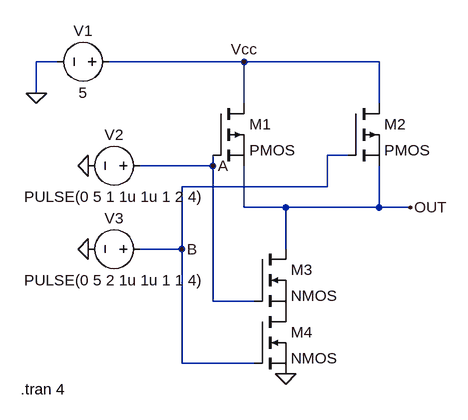
[diagram p0: schematic NAND.asc]
NAND.asc, the LTspice schematic file:
Version 4.1
SHEET 1 880 680
WIRE -128 -16 -160 -16
WIRE 160 -16 -48 -16
WIRE 368 -16 160 -16
WIRE -160 32 -160 -16
WIRE 160 48 160 -16
WIRE 368 48 368 -16
WIRE 320 128 288 128
WIRE 112 144 112 128
WIRE 112 144 0 144
WIRE 288 176 288 128
WIRE 288 176 64 176
WIRE 160 208 160 144
WIRE 224 208 160 208
WIRE 368 208 368 144
WIRE 368 208 224 208
WIRE 416 208 368 208
WIRE 64 272 64 176
WIRE 64 272 0 272
WIRE 224 272 224 208
WIRE 112 352 112 144
WIRE 176 352 112 352
WIRE 64 448 64 272
WIRE 176 448 64 448
FLAG 224 464 0
FLAG -160 32 0
FLAG 160 -16 Vcc
FLAG -80 144 0
FLAG -80 272 0
FLAG 112 144 A
FLAG 64 272 B
FLAG 416 208 OUT
SYMBOL pmos 112 48 R0
SYMATTR InstName M1
SYMBOL pmos 320 48 R0
SYMATTR InstName M2
SYMBOL voltage -32 -16 R90
WINDOW 0 -32 56 VBottom 2
WINDOW 3 32 56 VTop 2
WINDOW 123 0 0 Left 0
WINDOW 39 0 0 Left 0
SYMATTR InstName V1
SYMATTR Value 5
SYMBOL nmos 176 272 R0
SYMATTR InstName M3
SYMBOL nmos 176 368 R0
SYMATTR InstName M4
SYMBOL voltage 16 144 R90
WINDOW 0 -32 56 VBottom 2
WINDOW 3 32 56 VTop 2
WINDOW 123 0 0 Left 0
WINDOW 39 0 0 Left 0
SYMATTR InstName V2
SYMATTR Value PULSE(0 5 1 1u 1u 1 2 4)
SYMBOL voltage 16 272 R90
WINDOW 0 -32 56 VBottom 2
WINDOW 3 32 56 VTop 2
WINDOW 123 0 0 Left 0
WINDOW 39 0 0 Left 0
SYMATTR InstName V3
SYMATTR Value PULSE(0 5 2 1u 1u 1 1 4)
TEXT -184 488 Left 2 !.tran 4

The netlist it stands for:
* NAND.asc
M1 Vcc A OUT OUT PMOS
M2 Vcc B OUT OUT PMOS
V1 Vcc 0 5
M3 OUT A P001 P001 NMOS
M4 P001 B 0 0 NMOS
V2 A 0 PULSE(0 5 1 1u 1u 1 2 4)
V3 B 0 PULSE(0 5 2 1u 1u 1 1 4)
.model NMOS NMOS
.model PMOS PMOS
.lib standard.mos
.tran 4
.backanno
.end